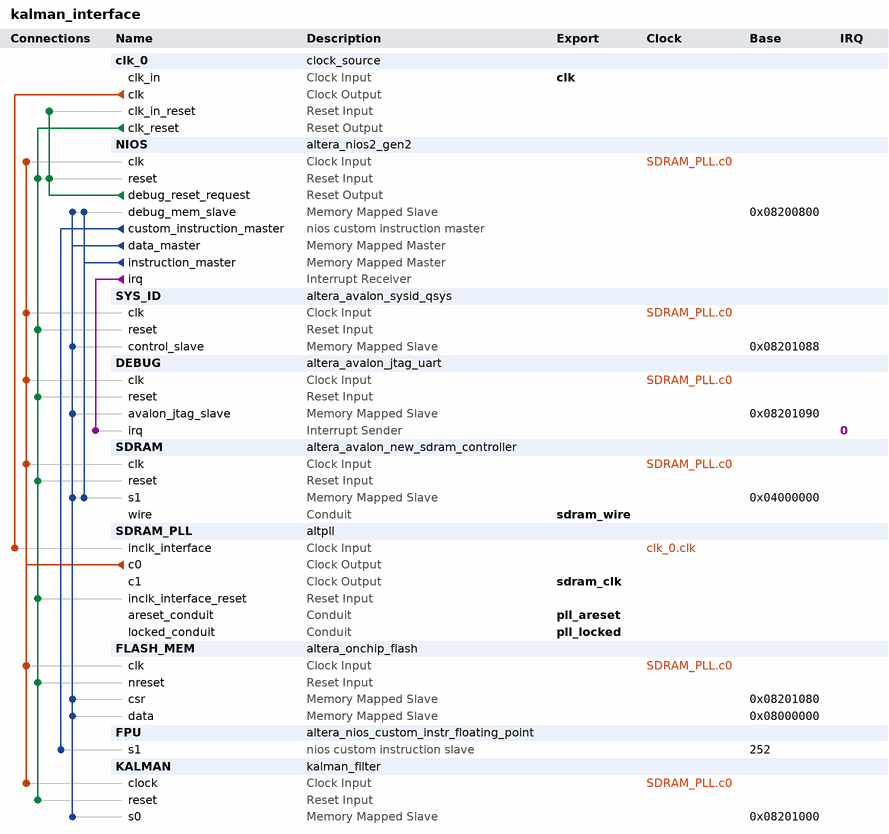
[diagram p0: system contents]
# Platform Designer (Qsys) system kalman_interface, MAX 10 10M50DAF484C7G
# Parameters at their usual value, and those the tool derives, are not listed.
package require -exact qsys 18.1
create_system kalman_interface
set_project_property DEVICE_FAMILY {MAX 10}
set_project_property DEVICE 10M50DAF484C7G

add_instance clk_0 clock_source 18.1
set_instance_parameter_value clk_0 clockFrequency 50000000

add_instance NIOS altera_nios2_gen2 18.1
set_instance_parameter_value NIOS dcache_size 2048
set_instance_parameter_value NIOS exceptionSlave SDRAM.s1
set_instance_parameter_value NIOS icache_size 4096
set_instance_parameter_value NIOS impl Fast
set_instance_parameter_value NIOS resetSlave SDRAM.s1

add_instance SYS_ID altera_avalon_sysid_qsys 18.1
set_instance_parameter_value SYS_ID id 0

add_instance DEBUG altera_avalon_jtag_uart 18.1
set_instance_parameter_value DEBUG simInteractiveOptions NO_INTERACTIVE_WINDOWS

add_instance SDRAM altera_avalon_new_sdram_controller 18.1
set_instance_parameter_value SDRAM TAC 5.5
set_instance_parameter_value SDRAM TRCD 20.0
set_instance_parameter_value SDRAM TRP 20.0
set_instance_parameter_value SDRAM casLatency 3
set_instance_parameter_value SDRAM columnWidth 10
set_instance_parameter_value SDRAM dataWidth 16
set_instance_parameter_value SDRAM generateSimulationModel false
set_instance_parameter_value SDRAM model single_Micron_MT48LC4M32B2_7_chip
set_instance_parameter_value SDRAM numberOfBanks 4
set_instance_parameter_value SDRAM numberOfChipSelects 1
set_instance_parameter_value SDRAM powerUpDelay 100.0
set_instance_parameter_value SDRAM refreshPeriod 15.625
set_instance_parameter_value SDRAM rowWidth 13

add_instance SDRAM_PLL altpll 18.1
set_instance_parameter_value SDRAM_PLL CLK0_DIVIDE_BY 1
set_instance_parameter_value SDRAM_PLL CLK0_MULTIPLY_BY 1
set_instance_parameter_value SDRAM_PLL CLK1_DIVIDE_BY 1
set_instance_parameter_value SDRAM_PLL CLK1_DUTY_CYCLE 50
set_instance_parameter_value SDRAM_PLL CLK1_MULTIPLY_BY 1
set_instance_parameter_value SDRAM_PLL CLK1_PHASE_SHIFT -3000
set_instance_parameter_value SDRAM_PLL INCLK0_INPUT_FREQUENCY 20000
set_instance_parameter_value SDRAM_PLL PORT_ARESET PORT_USED
set_instance_parameter_value SDRAM_PLL PORT_LOCKED PORT_USED
set_instance_parameter_value SDRAM_PLL PORT_clk1 PORT_USED
set_instance_parameter_value SDRAM_PLL PORT_clk2 PORT_UNUSED
set_instance_parameter_value SDRAM_PLL PORT_clk3 PORT_UNUSED

add_instance FLASH_MEM altera_onchip_flash 18.1
set_instance_parameter_value FLASH_MEM CONFIGURATION_MODE {Single Uncompressed Image with Memory Initialization}
set_instance_parameter_value FLASH_MEM SECTOR_ACCESS_MODE {Read and write,Read and write,Read and write,Read and write,Read and write}
set_instance_parameter_value FLASH_MEM initFlashContent false
set_instance_parameter_value FLASH_MEM initializationFileName altera_onchip_flash.hex
set_instance_parameter_value FLASH_MEM useNonDefaultInitFile false

add_instance FPU altera_nios_custom_instr_floating_point 18.1
set_instance_parameter_value FPU useDivider 0

add_instance KALMAN kalman_filter 1.0
set_instance_parameter_value KALMAN N 32
set_instance_parameter_value KALMAN Q 18

# connections
add_connection clk_0.clk SDRAM_PLL.inclk_interface clock
add_connection SDRAM_PLL.c0 DEBUG.clk clock
add_connection SDRAM_PLL.c0 FLASH_MEM.clk clock
add_connection SDRAM_PLL.c0 KALMAN.clock clock
add_connection SDRAM_PLL.c0 NIOS.clk clock
add_connection SDRAM_PLL.c0 SDRAM.clk clock
add_connection SDRAM_PLL.c0 SYS_ID.clk clock
add_connection clk_0.clk_reset DEBUG.reset reset
add_connection clk_0.clk_reset FLASH_MEM.nreset reset
add_connection clk_0.clk_reset KALMAN.reset reset
add_connection clk_0.clk_reset NIOS.reset reset
add_connection clk_0.clk_reset SDRAM.reset reset
add_connection clk_0.clk_reset SDRAM_PLL.inclk_interface_reset reset
add_connection clk_0.clk_reset SYS_ID.reset reset
add_connection NIOS.debug_reset_request clk_0.clk_in_reset reset
add_connection NIOS.debug_reset_request NIOS.reset reset
add_connection NIOS.data_master DEBUG.avalon_jtag_slave avalon
set_connection_parameter_value NIOS.data_master/DEBUG.avalon_jtag_slave baseAddress 0x08201090
add_connection NIOS.data_master FLASH_MEM.csr avalon
set_connection_parameter_value NIOS.data_master/FLASH_MEM.csr baseAddress 0x08201080
add_connection NIOS.data_master FLASH_MEM.data avalon
set_connection_parameter_value NIOS.data_master/FLASH_MEM.data baseAddress 0x08000000
add_connection NIOS.data_master KALMAN.s0 avalon
set_connection_parameter_value NIOS.data_master/KALMAN.s0 baseAddress 0x08201000
add_connection NIOS.data_master NIOS.debug_mem_slave avalon
set_connection_parameter_value NIOS.data_master/NIOS.debug_mem_slave baseAddress 0x08200800
add_connection NIOS.data_master SDRAM.s1 avalon
set_connection_parameter_value NIOS.data_master/SDRAM.s1 baseAddress 0x04000000
add_connection NIOS.data_master SYS_ID.control_slave avalon
set_connection_parameter_value NIOS.data_master/SYS_ID.control_slave baseAddress 0x08201088
add_connection NIOS.instruction_master NIOS.debug_mem_slave avalon
set_connection_parameter_value NIOS.instruction_master/NIOS.debug_mem_slave baseAddress 0x08200800
add_connection NIOS.instruction_master SDRAM.s1 avalon
set_connection_parameter_value NIOS.instruction_master/SDRAM.s1 baseAddress 0x04000000
add_connection NIOS.irq DEBUG.irq interrupt
set_connection_parameter_value NIOS.irq/DEBUG.irq irqNumber 0
add_connection NIOS.custom_instruction_master FPU.s1 nios_custom_instruction
set_connection_parameter_value NIOS.custom_instruction_master/FPU.s1 CIName fpu
set_connection_parameter_value NIOS.custom_instruction_master/FPU.s1 baseAddress 252

# exported interfaces
add_interface clk clock sink
set_interface_property clk EXPORT_OF clk_0.clk_in
add_interface pll_areset conduit end
set_interface_property pll_areset EXPORT_OF SDRAM_PLL.areset_conduit
add_interface pll_locked conduit end
set_interface_property pll_locked EXPORT_OF SDRAM_PLL.locked_conduit
add_interface sdram_clk clock source
set_interface_property sdram_clk EXPORT_OF SDRAM_PLL.c1
add_interface sdram_wire conduit end
set_interface_property sdram_wire EXPORT_OF SDRAM.wire

set_interconnect_requirement {$system} qsys_mm.clockCrossingAdapter HANDSHAKE
set_interconnect_requirement {$system} qsys_mm.enableEccProtection FALSE
set_interconnect_requirement {$system} qsys_mm.insertDefaultSlave FALSE
set_interconnect_requirement {$system} qsys_mm.maxAdditionalLatency 1

save_system kalman_interface.qsys
